# Altium project Protone.PrjPcb
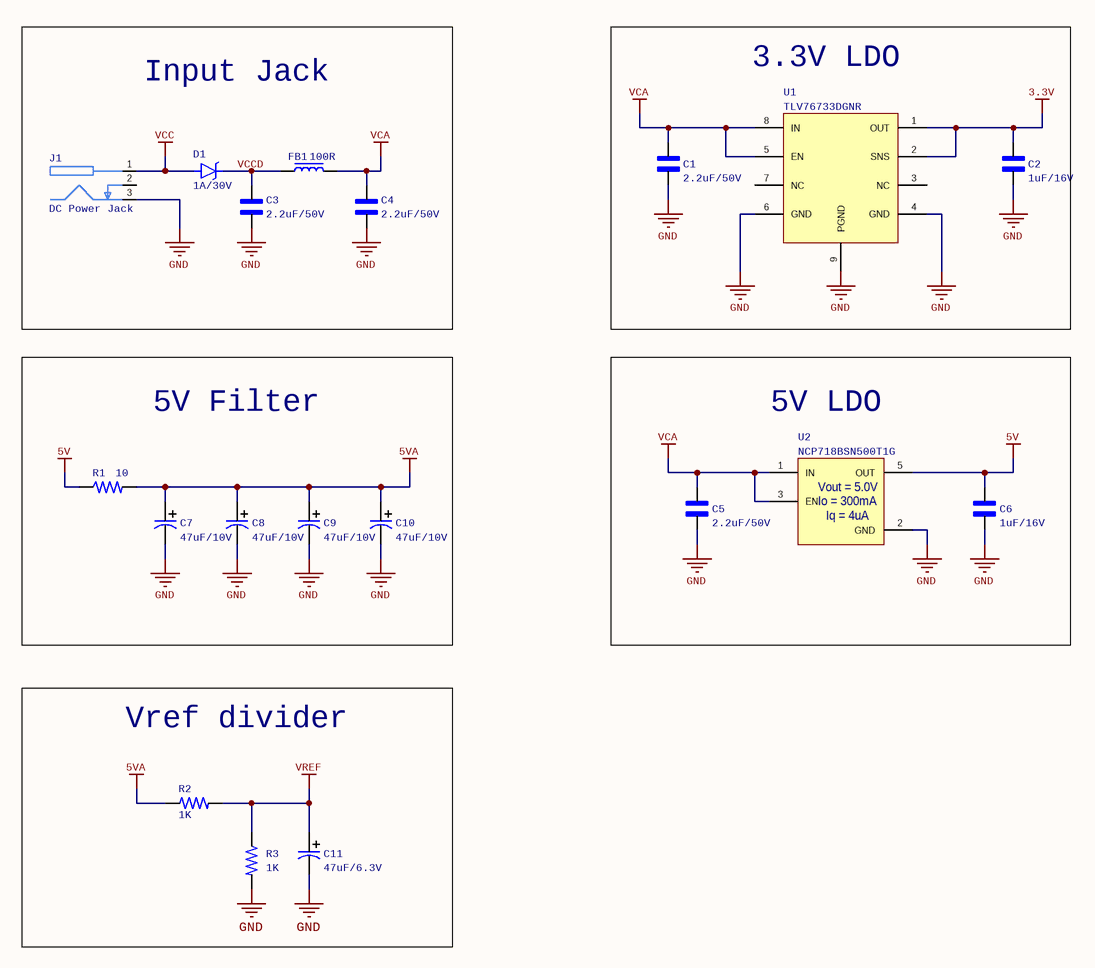
[diagram p0: [1] Power Supply.SchDoc]
5 sheets, 113 parts. Net scope: flat (ports and power ports of the same name join across sheets).
Board file: Protone.PcbDoc
Sheets:
  [1] Power Supply.SchDoc
  [2] Analog Front-End.SchDoc
  [3] Audio Codec.SchDoc
  [4] MCU.SchDoc
  [5] Connectors.SchDoc

## Sheet [1] Power Supply.SchDoc
size Letter

### Parts
C1  2.2uF/50V  [C1206]
C2  1uF/16V  [C0603]
C3  2.2uF/50V  [C1206]
C4  2.2uF/50V  [C1206]
C5  2.2uF/50V  [C1206]
C6  1uF/16V  [C0603]
C7  47uF/10V  [EIA1210]
C8  47uF/10V  [EIA1210]
C9  47uF/10V  [EIA1210]
C10  47uF/10V  [EIA1210]
C11  47uF/6.3V  [EIA1206]
D1  1A/30V  [SOD-323]
FB1  100R  [FB_0603]
J1  DC Power Jack  [DC Power Jack 2.1mm x 5.5mm]
R1  10  [R0603]
R2  1K  [R0603]
R3  1K  [R0603]
U1  TLV76733DGNR  [HVSSOP-8]
U2  NCP718BSN500T1G  [SOT23-5]

### Blocks framed on the sheet
Input Jack: C3 C4 D1 FB1 J1
3.3V LDO: C1 C2 U1
5V Filter: C7-C10 R1
5V LDO: C5 C6 U2
Vref divider: C11 R2 R3

### Nets
3.3V: C2.1 U1.1(OUT) U1.2(SNS)
5V: C6.1 R1.1 U2.5(OUT)
5VA: C7.1 C8.1 C9.1 C10.1 R1.2 R2.1
GND: C1.2 C2.2 C3.2 C4.2 C5.2 C6.2 C7.2 C8.2 C9.2 C10.2 C11.2 J1.3 R3.2 U1.4(GND) U1.6(GND) U1.9(PGND) U2.2(GND)
VCA: C1.1 C4.1 C5.1 FB1.2 U1.5(EN) U1.8(IN) U2.1(IN) U2.3(EN)
VCC: D1.A J1.1
VREF: C11.1 R2.2 R3.1
VCCD: C3.1 D1.C FB1.1

Not connected (* = marked no-connect by the designer): J1 2; U1 3(NC) 7(NC)

### Notes on the sheet
- (in symbol NCP718BSN500T1G) Vout = 5.0V; Io = 300mA; Iq = 4uA

### Library data of the parts
C1 C3-C5 = C1206 2.2uF/50V: MLCC 2.2uF 50V X7R 10% 1206; Manufacturer: KEMET; Manufacturer Part Number: C1206C225J5RECAUTO; Supplier 1: Mouser; Supplier Part Number 1: 80-C1206C225J5RECAUT; RoHS: Yes; Stock 1: 1416; Pricing 1: 1=0.26000, 10=0.11800, 50=0.11800, 100=0.10100, 1000=0.10100, 10000=0.10100 (USD)
C2 C6 = C0603 1uF/16V X5R: MLCC 1uF 16V X5R 10% SMD 0603 85C Paper T/R; Manufacturer: Yageo; Manufacturer Part Number: CC0603KRX5R7BB105; Dissipation Factor: 7%; Supplier 1: Mouser; Supplier Part Number 1: 603-CC603KRX5R7BB105; RoHS: Yes; Category: Ceramic Capacitors; Stock 1: 726921; Pricing 1: 1=0.17000, 10=0.09100, 50=0.09100, 100=0.04100, 1000=0.03400, 10000=0.02100 (USD); Mount: Surface Mount; Case/Package: 0603; Number of Pins: 2; Case Code (Imperial): 0603; Case Code (Metric): 1608; Min Operating Temperature: -55°C; Max Operating Temperature: 85°C; Capacitance: 1uF; Tolerance: 10%; Dielectric: X5R; Voltage Rating: 16V; Voltage Rating (DC): 16V; Packaging: Tape and Reel; Package Quantity: 4000; Termination: SMD/SMT; Resistor Type: Ceramic; Series: CC; Construction: Flat; Length: 1.6mm; Width: 0.8mm; Height: 0.8mm; Thickness: 0.035inch; Depth: 0.8mm; Radiation Hardening: No; REACH SVHC: Unknown; Lead Free: Lead Free; Halogen Free: Halogen Free; RoHS Compliant: Yes
C7-C10 = TANT 47UF/10V: Tantalum Capacitors - Solid SMD 10V 47uF 10%; Manufacturer: Kyocera AVX; Manufacturer Part Number: TAJB476K010RNJ; ESR (Equivalent Series Resistance): 1R; Leakage Current: 4.7uA; Polarity: Polar; Dissipation Factor: 8%; Supplier 1: Mouser; RoHS: Yes; Category: Tantalum Capacitors; Stock 1: 71514; Pricing 1: 1=0.46, 10=0.234, 50=0.234, 100=0.201, 1000=0.127, 10000=0.103 (USD); Mount: Surface Mount,PCB; Case/Package: 1210; Case Code (Metric): 3528; Case Code (Imperial): 1411; Dielectric Material: Tantalum; Min Operating Temperature: -55°C; Max Operating Temperature: 125°C; Capacitance: 47uF; Tolerance: 10%; Voltage Rating: 10V; Package Quantity: 2000; Packaging: Tape and Reel; Voltage Rating (DC): 10V; Termination: SMD/SMT; Voltage: 10V; Features: General Purpose; Series: TAJ; Length: 3.5mm; Width: 2.8mm; Height: 1.9mm; Depth: 2.8mm; Radiation Hardening: No; Lead Free: Lead Free; RoHS Compliant: Yes; Reach SVHC Compliant: No; Supplier Part Number 1: 581-TAJB476K010; Number of Pins: 2; Construction: Flat; Lead Pitch: 1.4mm
C11 = TANT 47UF/6.3V: Tantalum Capacitors - Solid SMD 6.3V 47uF 10%; Manufacturer: Kyocera AVX; Manufacturer Part Number: TAJA476K006SNJV; Supplier 1: Mouser; Supplier Part Number 1: 581-TAJA476K006SNJV; RoHS: Yes; Category: Tantalum Capacitors; Stock 1: 97469; Pricing 1: 1=0,57000, 10=0,39900, 50=0,39900, 100=0,20200, 1000=0,15200, 10000=0,12500 (USD); Case/Package: Radial; Voltage Rating (DC): 6.3V; Capacitance: 47uF; Tolerance: 10%; Lead Free: Lead Free; RoHS Compliant: Yes
D1 = Schottky BAT760Q-7: 30V 1A SOD323 DIODE SCHOTTKY; Manufacturer: Diodes; Supplier 1: Mouser; Supplier Part Number 1: 621-BAT760Q-7; Manufacturer Part Number: BAT760Q-7; RoHS: Yes; Category: Rectifier Diodes; Stock 1: 1305; Pricing 1: 1=0.41000, 10=0.27600, 50=0.27600, 100=0.14400, 1000=0.10000, 10000=0.07700 (USD); Mount: Surface Mount; Packaging: Tape and Reel; Average Rectified Current: 1A; Max Reverse Voltage (DC): 30V; RoHS Compliant: Yes
FB1 = FB_0603: Ferrite Bead SMD 0603
J1 = DC Power Jack 2.1mm x 5.5mm: DC Power Connectors Power Jack/Connector 2.1mm x 5.5mm; Manufacturer: Gravitech; Manufacturer Part Number: CON-SOCJ-2155; Supplier 1: Mouser; Supplier Part Number 1: 992-CON-SOCJ-2155; RoHS: Yes; Category: Uncategorized; Stock 1: 2595; Pricing 1: 1=1.00000, 5=1.00000 (USD); Color: Black; Connector Type: Power; Contact Gender: Female
R1 = R0603 10: RES 0603 10 OHM 0.5% 1/10W; Manufacturer: Yageo; Manufacturer Part Number: RT0603DRE0710RL; Resistance: 10R; Max Power Dissipation: 100mW; Voltage Rating (DC): 50V; Supplier 1: Mouser; Supplier Part Number 1: 603-RT0603DRE0710RL; RoHS: Yes; Category: Chip SMD Resistors; Case/Package: 0603; Case Code (Metric): 1608; Case Code (Imperial): 0603; Tolerance: 0.5%; Resistor Type: Thin Film; Number of Terminations: 2
R2 R3 = R0603 1K: Res Thick Film 0603 1K Ohm 1% 1/10W ±50ppm/°C Molded SMD Paper T/R; Manufacturer: Yageo; Manufacturer Part Number: RE0603FRE071KL; Resistance: 1kR; Max Power Dissipation: 100mW; Supplier 1: Mouser; Supplier Part Number 1: 603-RE0603FRE071KL; RoHS: Yes; Category: Chip SMD Resistors; Stock 1: 21464; Pricing 1: 1=0.11000, 10=0.03800, 50=0.03800, 100=0.01700, 1000=0.00800, 10000=0.00500 (USD); Case/Package: 0603; Min Operating Temperature: -55°C; Max Operating Temperature: 155°C; Packaging: Tape and Reel; Resistor Type: Thick Film; Number of Terminations: 2; Tolerance: 1%; Temperature Coefficient: 50ppm/°C; Features: Moisture Resistant; Length: 0.063inch; Width: 0.032inch; Height: 0.022inch; RoHS Compliant: Yes; ComponentLink1URL: http://www.yageo.com/NewPortal/yageodocoutput?fileName=/pdf/R-Chip/PYu-RE_105_RoHS_L_4.pdf&src-supplier=Digi-Key; ComponentLink1Description: http://www.yageo.com/NewPortal/yageodocoutput?fileName=/pdf/R-Chip/PYu-RE_105_RoHS_L_4.pdf&src-supplier=Digi-Key
U1 = TLV76733DGNR: Fixed-output, 1-A, 16-V, positive-voltage low-dropout (LDO) linear regulator 8-HVSSOP -40 to 125; Manufacturer: Texas Instruments; Supplier 1: Mouser; Manufacturer Part Number: TLV76733DGNR; RoHS: Yes; Category: Integrated Circuits (ICs); Stock 1: 27181; Pricing 1: 1=0.88, 10=0.784, 50=0.744, 100=0.611, 1000=0.399, 10000=0.33 (USD); Supplier Part Number 1: 595-TLV76733DGNR
U2 = NCP718BSN500T1G: LDO Regulator, 300 mA, Wide Vin, Ultra-Low Iq Fixed 5.0V, Non-Active Discharge, TSOT23-5; Manufacturer: ON Semiconductor; Supplier 1: Mouser; Manufacturer Part Number: NCP718BSN500T1G; RoHS: Yes; Category: Voltage Regulators - Linear; Stock 1: 32274; Pricing 1: 1=0.61, 10=0.534, 50=0.534, 100=0.37, 1000=0.22, 10000=0.182 (USD); RoHS Compliant: Yes; Supplier Part Number 1: 863-NCP718BSN500T1G

## Sheet [2] Analog Front-End.SchDoc
size Letter
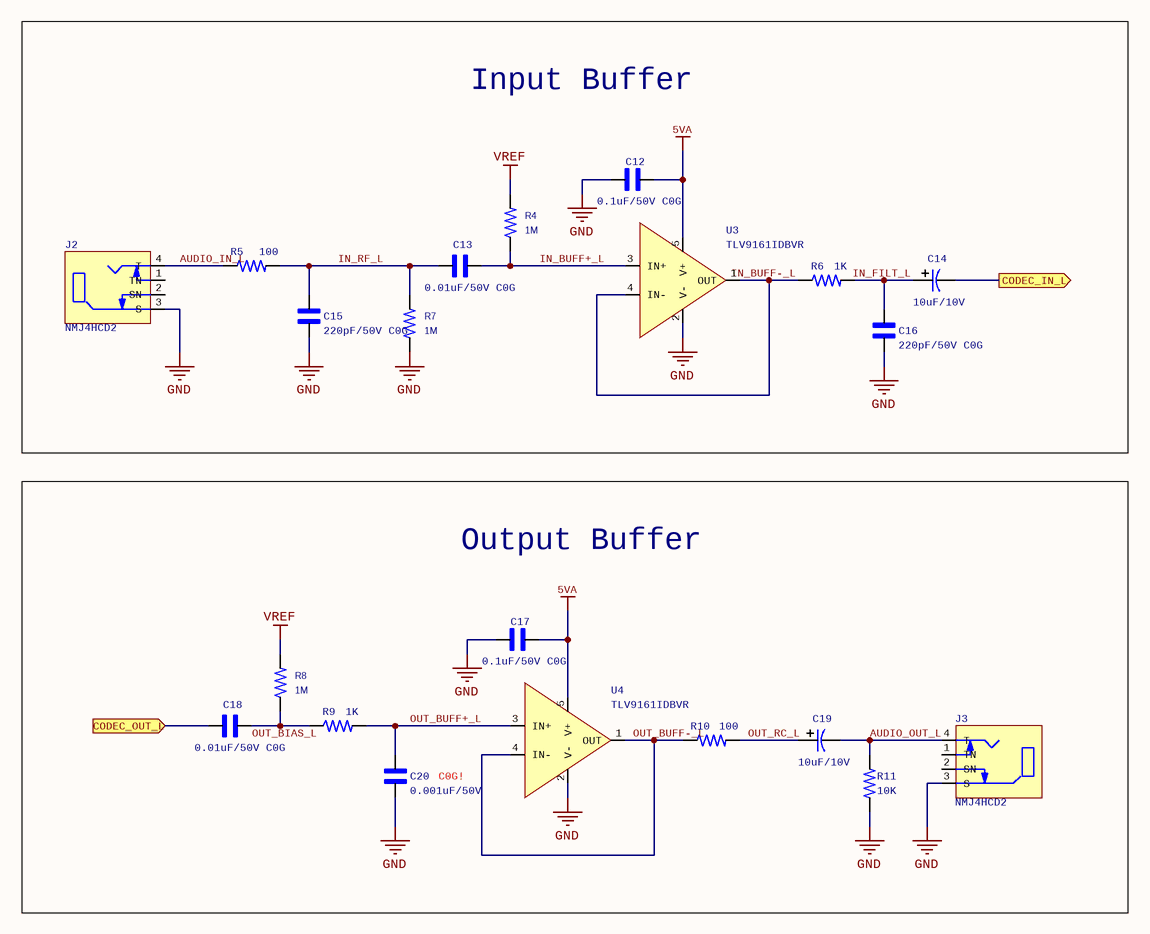
[diagram p1: [2] Analog Front-End.SchDoc]

### Parts
C12  0.1uF/50V C0G  [C0603]
C13  0.01uF/50V C0G  [C0603]
C14  10uF/10V  [EIA1206]
C15  220pF/50V C0G  [C0603]
C16  220pF/50V C0G  [C0603]
C17  0.1uF/50V C0G  [C0603]
C18  0.01uF/50V C0G  [C0603]
C19  10uF/10V  [EIA1206]
C20  0.001uF/50V  [C0603]
J2  NMJ4HCD2  [NMJ4HCD2]
J3  NMJ4HCD2  [NMJ4HCD2]
R4  1M  [R0603]
R5  100  [R0603]
R6  1K  [R0603]
R7  1M  [R0603]
R8  1M  [R0603]
R9  1K  [R0603]
R10  100  [R0603]
R11  10K  [R0603]
U3  TLV9161IDBVR  [SOT23-5]
U4  TLV9161IDBVR  [SOT23-5]

### Blocks framed on the sheet
Input Buffer: C12-C16 J2 R4-R7 U3
Output Buffer: C17-C20 J3 R8-R11 U4

### Ports
CODEC_IN_L (out), CODEC_OUT_L (in)

### Nets
5VA: C12.1 C17.1 U3.5(V+) U4.5(V+)
GND: C12.2 C15.2 C16.2 C17.2 C20.1 J2.3(S) J3.3(S) R7.1 R11.1 U3.2(V-) U4.2(V-)
VREF: R4.2 R8.2
AUDIO_IN_L: J2.4(T) R5.1
AUDIO_OUT_L: C19.2 J3.4(T) R11.2
CODEC_IN_L: C14.2 ; port CODEC_IN_L
CODEC_OUT_L: C18.1 ; port CODEC_OUT_L
IN_BUFF+_L: C13.2 R4.1 U3.3(IN+)
IN_BUFF-_L: R6.1 U3.1(OUT) U3.4(IN-)
IN_FILT_L: C14.1 C16.1 R6.2
IN_RF_L: C13.1 C15.1 R5.2 R7.2
OUT_BIAS_L: C18.2 R8.1 R9.1
OUT_BUFF+_L: C20.2 R9.2 U4.3(IN+)
OUT_BUFF-_L: R10.1 U4.1(OUT) U4.4(IN-)
OUT_RC_L: C19.1 R10.2

Not connected (* = marked no-connect by the designer): J2 1(TN) 2(SN); J3 1(TN) 2(SN)

### Notes on the sheet
- C0G!

### Library data of the parts
C12 C17 = C0603 0.1uF/50V: MLCC 0.1uF 50V C0G 10% 0603; Manufacturer: TDK; Manufacturer Part Number: C1608X5R1H104K080AA; Dielectric Material: Ceramic; Capacitance: 100nF; Dielectric: X5R; Supplier 1: Mouser; Supplier Part Number 1: 810-C1608X5R1H104K; RoHS: Yes; Category: Ceramic Capacitors; Stock 1: 520600; Pricing 1: 1=0.12000, 10=0.04500, 100=0.03700, 500=0.02600, 1000=0.02100, 4000=0.01800 (USD); Mount: Surface Mount; Case/Package: 0603; Number of Pins: 2; Case Code (Metric): 1608; Case Code (Imperial): 0603; Weight: 7.1E-05oz; Min Operating Temperature: -55°C; Max Operating Temperature: 85°C; Tolerance: 10%; Voltage Rating: 50V; Packaging: Tape and Reel; Voltage Rating (DC): 50V; Termination: SMD/SMT; Package Quantity: 1; Resistor Type: Ceramic; Length: 1.6mm; Width: 0.031inch; Height: 0.8mm; Depth: 0.8mm; Thickness: 0.035inch; Radiation Hardening: No; REACH SVHC: No SVHC; Lead Free: Lead Free; Supplier 2: Mouser; Supplier Part Number 2: 187-CL10B104KB8NNNC
C13 C18 = C0603 0.01uF/50V C0G: MLCC 0.01uF 50V C0G 5% 0603; Manufacturer: Murata; Manufacturer Part Number: GRM1885C1H103JA01J; Capacitance: 10nF; Material: 4241ConductorMaterial; Temperature Coefficient: 30ppm/°C; Supplier 1: Mouser; Supplier Part Number 1: 81-GRM1885C1H103JA1J; RoHS: Yes; Category: Ceramic Capacitors; Stock 1: 193832; Pricing 1: 1=0.13, 10=0.052, 50=0.052, 100=0.03, 1000=0.025, 10000=0.018 (USD); Mount: Surface Mount; Case/Package: 0603; Case Code (Metric): 1608; Case Code (Imperial): 0603; Min Operating Temperature: -55°C; Max Operating Temperature: 125°C; Package Quantity: 10000; Packaging: Tape and Reel; Tolerance: 5%; Voltage Rating: 50V; Dielectric: C0G; Termination: SMD/SMT; Voltage Rating (DC): 50V; Series: GRM; Length: 1.6mm; Width: 0.8mm; Height: 0.8mm; RoHS Compliant: Yes; Weight: 0.000222oz
C14 C19 = TANT 10UF/10V: Tantalum Capacitors - Solid SMD 10V 10uF 10%; Manufacturer: KEMET; Manufacturer Part Number: T491A106K010AT; ESR (Equivalent Series Resistance): 4R; Life (Hours): 2000Hour; Polarity: Polar; Dissipation Factor: 6%; Leakage Current: 1uA; Ripple Current: 137mA; Supplier 1: Mouser; RoHS: Yes; Category: Tantalum Capacitors; Stock 1: 88800; Supplier Part Number 1: 80-T491A106K010; Mount: Surface Mount,PCB; Case/Package: 1206; Case Code (Metric): 3216; Case Code (Imperial): 1206; Dielectric Material: Tantalum; Min Operating Temperature: -55°C; Max Operating Temperature: 125°C; Capacitance: 10uF; Tolerance: 10%; Packaging: Tape and Reel; Voltage Rating: 10V; Features: General Purpose; Package Quantity: 2000; Termination: SMD/SMT; Voltage Rating (DC): 10V; Voltage: 10V; Length: 3.2mm; Width: 0.063inch; Height: 1.6mm; Depth: 1.6mm; Height - Seated (Max): 0.071inch; Lead Free: Lead Free; REACH SVHC: No SVHC; Supplier 2: LCSC; Supplier Part Number 2: C110052
C15 C16 = C0603 220pF/50V C0G: MLCC 220pF 50V C0G 5% 0603; Manufacturer: KEMET; Manufacturer Part Number: C0603C221J5GACTU; Dielectric Material: Ceramic; Material: 4241ConductorMaterial; Dissipation Factor: 0.1%; Temperature Coefficient: 30ppm/°C; Supplier 1: Mouser; Supplier Part Number 1: 80-C0603C221J5G; RoHS: Yes; Category: Ceramic Capacitors; Stock 1: 174318; Pricing 1: 1=0.1, 10=0.027, 50=0.027, 100=0.016, 1000=0.011, 10000=0.007 (USD); Mount: Surface Mount; Case/Package: 0603; Min Operating Temperature: -55°C; Max Operating Temperature: 125°C; Packaging: Tape and Reel; Tolerance: 5%; Capacitance: 220pF; Dielectric: C0G; Termination: SMD/SMT; Voltage Rating (DC): 50V; Voltage: 50V; Length: 1.6mm; Height: 0.8mm; Depth: 0.8mm; Radiation Hardening: No; Number of Pins: 2; Case Code (Imperial): 0603; Case Code (Metric): 1608; Package Quantity: 1; Voltage Rating: 50V; Series: C; Construction: Flat; Voltage Rating (AC): 50V; Width: 0.8mm; Thickness: 0.034inch; Lead Pitch: 0.7mm; Lead Free: Lead Free; Reach SVHC Compliant: No; RoHS Compliant: Yes
C20 = C0603 0.001uF/50V: MLCC 0.001uF 50V X5R 10% 0603; Manufacturer: Samsung; Manufacturer Part Number: CL10B102KB8NNNL; Capacitance: 1nF; Dielectric: X7R; Supplier 1: Mouser; Supplier Part Number 1: 187-CL10B102KB8NNNL; RoHS: Yes; Category: Ceramic Capacitors; Stock 1: 55616; Pricing 1: 1=0.10000, 10=0.03500, 50=0.03500, 100=0.01600, 1000=0.00900, 10000=0.00600 (USD); Mount: Surface Mount; Case/Package: 0603; Min Operating Temperature: -55°C; Max Operating Temperature: 125°C; Package Quantity: 15000; Packaging: Tape and Reel; Tolerance: 10%; Voltage Rating: 50V; Voltage Rating (DC): 50V; Series: CL; Construction: Flat; Length: 1.6mm; Width: 0.031inch; Height: 0.8mm; Thickness: 0.035inch; Depth: 0.8mm; Radiation Hardening: No; Lead Free: Lead Free; RoHS Compliant: Yes
J2 J3 = TS Audio Jack 6.3mm: Phone Connectors 2C MONO 2-SPST NC; Manufacturer: Neutrik; Number of Terminals/Pins: 4; Max Current Rating: 3A; Gender: Female; Voltage Rating: 50V; Number of Ports: 1; Number of Contacts: 2; Supplier 1: Mouser; Supplier Part Number 1: 550-12202; Manufacturer Part Number: NMJ4HCD2; RoHS: Yes; Category: Audio / Video Connectors; Stock 1: 39770; Pricing 1: 1=1,51000, 10=1,39000, 50=1,36000, 100=1,18000, 1000=1,11000, 10000=1,10000 (USD); Mount: Through Hole; Number of Pins: 4; Contact Plating: Silver; Color: Black; Contact Material: Brass; Weight: 0.246918oz; Housing Material: Polyamide; Min Operating Temperature: -25°C; Max Operating Temperature: 70°C; Package Quantity: 200; Termination: Through Hole; Orientation: Horizontal; Series: M; RoHS Compliant: Yes; ComponentLink1URL: https://datasheet.ciiva.com/16148/210-199761-16148179.pdf?src-supplier=Onlinecomponents.com; ComponentLink1Description: https://datasheet.ciiva.com/16148/210-199761-16148179.pdf?src-supplier=Onlinecomponents.com
R4 R7 R8 = R0603 1M: RES SMD 1M OHM 1% 1/10W 0603; Manufacturer: Yageo; Manufacturer Part Number: RC0603FR-071ML; Voltage Rating: 75V; Voltage Rating (DC): 50V; Resistance: 1MR; Power Rating: 100mW; Temperature Coefficient: 100ppm/°C; Application(s): HIGH RELIABILITY; Supplier 1: Mouser; Supplier Part Number 1: 603-RC0603FR-071ML; RoHS: Yes; Category: Chip SMD Resistors; Stock 1: 1321822; Pricing 1: 1=0.10000, 10=0.01800, 50=0.01800, 100=0.00700, 1000=0.00400, 10000=0.00200 (USD); Case/Package: 0603; Number of Pins: 2; Case Code (Imperial): 0603; Case Code (Metric): 1608; Weight: 0.000847oz; Min Operating Temperature: -55°C; Max Operating Temperature: 155°C; Tolerance: 1%; Packaging: Cut Tape; Package Quantity: 5000; Termination: SMD/SMT; Resistor Type: Thick Film; Type: General Purpose; Series: RC; Technology: THICK FILM; Length: 1.6mm; Width: 0.8mm; Height: 0.45mm; Depth: 0.8mm; RoHS Compliant: Yes; REACH SVHC: No SVHC; Military Standard: Not; Lead Free: Lead Free
R5 R10 = R0603 100: RES 0603 100 OHM 1% 1/10W; Manufacturer: Yageo; Manufacturer Part Number: RC0603FR-07100RL; Resistance: 100R; Temperature Coefficient: 100ppm/°C; Power Rating: 100mW; Voltage Rating: 50V; Supplier 1: Mouser; Supplier Part Number 1: 603-RC0603FR-07100RL; RoHS: Yes; Category: Chip SMD Resistors; Stock 1: 62434; Pricing 1: 1=0.10000, 10=0.02200, 50=0.02200, 100=0.00800, 1000=0.00600, 10000=0.00400 (USD); Case/Package: 0603; Case Code (Imperial): 0603; Case Code (Metric): 1608; Min Operating Temperature: -55°C; Max Operating Temperature: 155°C; Tolerance: 1%; Resistor Type: Thick Film; Packaging: Tape and Reel; Termination: SMD/SMT; Number of Terminations: 2; Length: 1.6mm; Height: 0.022inch; Width: 0.031inch; Depth: 0.8mm; Lead Free: Lead Free; Military Standard: Not; Contact Plating: Tin,Matte; Weight: 7.1E-05oz; Size Code: 0603; Max Power Dissipation: 100mW; Features: Moisture Resistant,Automotive AEC-Q200; Series: AC; Construction: Rectangular; Radiation Hardening: No; RoHS Compliant: Yes
R6 R9 = R0603 1K: as R2 on sheet [1] Power Supply; Supplier 1: Mouser; Supplier Part Number 1: 603-RE0603FRE071KL; RoHS: Yes; Category: Chip SMD Resistors; Stock 1: 21464; Pricing 1: 1=0.11000, 10=0.03800, 50=0.03800, 100=0.01700, 1000=0.00800, 10000=0.00500 (USD); Case/Package: 0603; Min Operating Temperature: -55°C; Max Operating Temperature: 155°C; Packaging: Tape and Reel; Resistor Type: Thick Film; Number of Terminations: 2; Tolerance: 1%; Temperature Coefficient: 50ppm/°C; Features: Moisture Resistant; Length: 0.063inch; Width: 0.032inch; Height: 0.022inch; RoHS Compliant: Yes; ComponentLink1URL: http://www.yageo.com/NewPortal/yageodocoutput?fileName=/pdf/R-Chip/PYu-RE_105_RoHS_L_4.pdf&src-supplier=Digi-Key; ComponentLink1Description: http://www.yageo.com/NewPortal/yageodocoutput?fileName=/pdf/R-Chip/PYu-RE_105_RoHS_L_4.pdf&src-supplier=Digi-Key
R11 = R0603 10K: RES 0603 10K OHM 1% 1/10W; Manufacturer: Yageo; Manufacturer Part Number: RC0603FR-0710KP; Resistance: 10kR; Max Power Dissipation: 100mW; Temperature Coefficient: 150ppm/°C; Supplier 1: Mouser; Supplier Part Number 1: 603-RC0603FR-0710KP; RoHS: Yes; Category: Chip SMD Resistors; Stock 1: 6316; Pricing 1: 1=0.18000, 10=0.04200, 50=0.04200, 100=0.01400, 1000=0.01000, 10000=0.00600 (USD); Case/Package: 0603; Case Code (Metric): 1608; Case Code (Imperial): 0603; Min Operating Temperature: -55°C; Max Operating Temperature: 155°C; Packaging: Tape and Reel; Tolerance: 1%; Resistor Type: Thick Film; Number of Terminations: 2; Features: Moisture Resistant; Length: 0.063inch; Width: 0.031inch; Height: 0.022inch; RoHS Compliant: Yes
U3 U4 = TLV9161IDBVR: Single 10-MHz, 16-V rail-to-rail input/output, very low noise, high slew rate op amp 5-SOT-23 -40 to 125; Manufacturer: Texas Instruments; Supplier 1: Mouser; Manufacturer Part Number: TLV9161IDBVR; RoHS: No; Category: Amplifiers - Op Amps, Buffer, Instrumentation; Stock 1: 20844; Pricing 1: 1=0.94, 10=0.839, 50=0.839, 100=0.654, 1000=0.435, 10000=0.375 (USD); Supplier Part Number 1: 595-TLV9161IDBVR

## Sheet [3] Audio Codec.SchDoc
size Letter
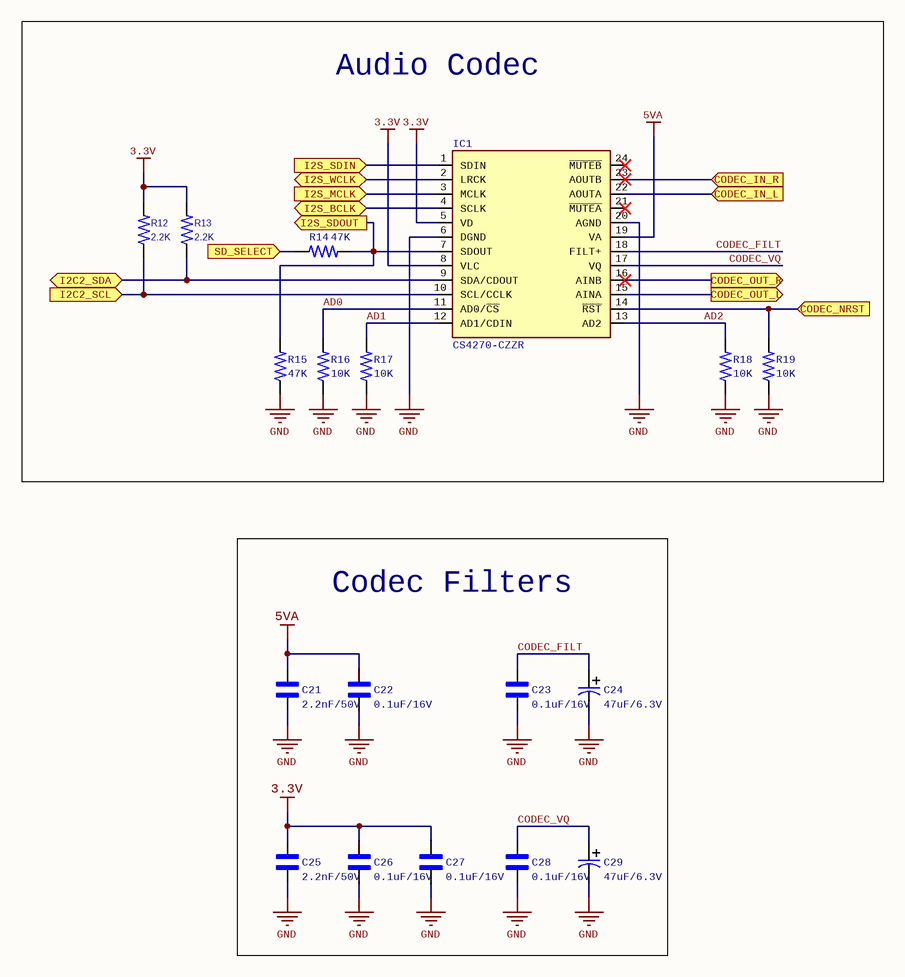
[diagram p2: [3] Audio Codec.SchDoc]

### Parts
C21  2.2nF/50V  [C0603]
C22  0.1uF/16V  [C0603]
C23  0.1uF/16V  [C0603]
C24  47uF/6.3V  [EIA1206]
C25  2.2nF/50V  [C0603]
C26  0.1uF/16V  [C0603]
C27  0.1uF/16V  [C0603]
C28  0.1uF/16V  [C0603]
C29  47uF/6.3V  [EIA1206]
IC1  CS4270-CZZR  [TSSOP-24]
R12  2.2K  [R0603]
R13  2.2K  [R0603]
R14  47K  [R0603]
R15  47K  [R0603]
R16  10K  [R0603]
R17  10K  [R0603]
R18  10K  [R0603]
R19  10K  [R0603]

### Blocks framed on the sheet
Audio Codec: IC1 R12-R19
Codec Filters: C21-C29

### Ports
CODEC_IN_L (in), CODEC_IN_R (in), CODEC_NRST (in), CODEC_OUT_L (out), CODEC_OUT_R (out), I2C2_SCL (in), I2C2_SDA (bidir), I2S_BCLK (bidir), I2S_MCLK (in), I2S_SDIN (in), I2S_SDOUT (out), I2S_WCLK (bidir), SD_SELECT (in)

### Nets
3.3V: C25.1 C26.2 C27.2 IC1.5(VD) IC1.8(VLC) R12.2 R13.2
5VA: C21.1 C22.2 IC1.19(VA)
GND: C21.2 C22.1 C23.1 C24.2 C25.2 C26.1 C27.1 C28.1 C29.2 IC1.6(DGND) IC1.20(AGND) R15.1 R16.1 R17.1 R18.1 R19.1
AD0: IC1.11(AD0/~{CS}) R16.2
AD1: IC1.12(AD1/CDIN) R17.2
AD2: IC1.13(AD2) R18.2
CODEC_FILT: C23.2 C24.1 IC1.18(FILT+)
CODEC_IN_L: IC1.22(AOUTA) ; port CODEC_IN_L
CODEC_IN_R: IC1.23(AOUTB) ; port CODEC_IN_R
CODEC_NRST: IC1.14(~{RST}) R19.2 ; port CODEC_NRST
CODEC_OUT_L: IC1.15(AINA) ; port CODEC_OUT_L
CODEC_OUT_R: IC1.16(AINB) ; port CODEC_OUT_R
CODEC_VQ: C28.2 C29.1 IC1.17(VQ)
I2C2_SCL: IC1.10(SCL/CCLK) R12.1 ; port I2C2_SCL
I2C2_SDA: IC1.9(SDA/CDOUT) R13.1 ; port I2C2_SDA
I2S_BCLK: IC1.4(SCLK) ; port I2S_BCLK
I2S_MCLK: IC1.3(MCLK) ; port I2S_MCLK
I2S_SDIN: IC1.1(SDIN) ; port I2S_SDIN
I2S_SDOUT: IC1.7(SDOUT) R14.2 R15.2 ; port I2S_SDOUT
I2S_WCLK: IC1.2(LRCK) ; port I2S_WCLK
SD_SELECT: R14.1 ; port SD_SELECT

Not connected (* = marked no-connect by the designer): IC1 21(~{MUTEA})* 24(~{MUTEB})*

### Library data of the parts
C21 C25 = C0603 2.2nF/50V: MLCC 2.2nF 10V X5R 10% 0603; Manufacturer: Samsung; Manufacturer Part Number: CL10B222KB8NFNC; Voltage Rating: 50V; Dielectric: X7R; Supplier 1: Mouser; Supplier Part Number 1: 187-CL10B222KB8NFNC; RoHS: Yes; Category: Ceramic Capacitors; Stock 1: 114857; Pricing 1: 1=0.10000, 10=0.03800, 50=0.03800, 100=0.01700, 1000=0.00900, 10000=0.00600 (USD); Mount: Surface Mount; Case/Package: 0603; Case Code (Metric): 1608; Case Code (Imperial): 0603; Min Operating Temperature: -55°C; Max Operating Temperature: 125°C; Package Quantity: 1; Packaging: Tape and Reel; Capacitance: 2.2nF; Tolerance: 10%; Series: CL; Construction: Flat; Length: 0.063inch; Width: 0.031inch; Height: 0.8mm; Thickness: 0.035inch; Depth: 0.8mm; Radiation Hardening: No; RoHS Compliant: Yes
C22 C23 C26-C28 = C0603 0.1uF/16V: MLCC 0.1UF, 16V, X5R, 10%, 0603.; Manufacturer: Kyocera AVX; Manufacturer Part Number: 0603YD104KAT2A; Capacitance: 100nF; Supplier 1: Mouser; Supplier Part Number 1: 581-0603YD104KAT2A; RoHS: Yes; Category: Ceramic Capacitors; Stock 1: 3315; Pricing 1: 1=0.26000, 10=0.11400, 50=0.11400, 100=0.09700, 1000=0.05900, 10000=0.04800 (USD); Mount: Surface Mount; Case/Package: 0603; Number of Pins: 2; Case Code (Imperial): 0603; Case Code (Metric): 1608; Min Operating Temperature: -55°C; Max Operating Temperature: 85°C; Package Quantity: 4000; Voltage Rating: 16V; Voltage Rating (DC): 16V; Tolerance: 10%; Packaging: Tape and Reel; Dielectric: X5R; Termination: SMD/SMT; Length: 1.6mm; Width: 0.81mm; Height: 0.9mm; Thickness: 0.035inch; Depth: 0.81mm; Lead Free: Lead Free; ComponentLink1URL: https://datasheet.ciiva.com/11504/cx5r-11504040.pdf?src-supplier=Avnet; ComponentLink1Description: https://datasheet.ciiva.com/11504/cx5r-11504040.pdf?src-supplier=Avnet; ComponentLink2URL: https://datasheet.ciiva.com/208/cx5r-208121.pdf?src-supplier=Digi-Key; ComponentLink2Description: https://datasheet.ciiva.com/208/cx5r-208121.pdf?src-supplier=Digi-Key
C24 C29 = TANT 47UF/6.3V: as C11 on sheet [1] Power Supply; Supplier 1: Mouser; Supplier Part Number 1: 581-TAJA476K006SNJV; RoHS: Yes; Category: Tantalum Capacitors; Stock 1: 97469; Pricing 1: 1=0,57000, 10=0,39900, 50=0,39900, 100=0,20200, 1000=0,15200, 10000=0,12500 (USD); Case/Package: Radial; Voltage Rating (DC): 6.3V; Capacitance: 47uF; Tolerance: 10%; Lead Free: Lead Free; RoHS Compliant: Yes
IC1 = CS4270-CZZR: Audio Codec 2ADC / 2DAC 24-Bit 24-Pin TSSOP T/R (Alt: CS4270-CZZR); Manufacturer: Cirrus Logic; Interface: I2C,SPI,Serial; Resolution: 24b; Number of A/D Converters: 2; Sampling Rate: 216KS/s; Supplier 1: Mouser; Manufacturer Part Number: CS4270-CZZR; RoHS: Yes; Category: CODECs; Stock 1: 20885; Pricing 1: 1=7.04, 10=6.36, 50=6.06, 100=5.27, 1000=4.4, 10000=4.4 (USD); Mount: Surface Mount; Case/Package: TSSOP; Number of Pins: 24; Contact Plating: Tin,Matte; Min Operating Temperature: -10°C; Max Operating Temperature: 70°C; Packaging: Tape and Reel; Package Quantity: 4000; Number of D/A Converters: 2; Series: -; RoHS Compliant: Yes; Supplier Part Number 1: 777-CS4270-CZZR
R12 R13 = R0603 2.2K: RES 0603 2.2K OHM 1% 1/10W; Manufacturer: Yageo; Manufacturer Part Number: RC0603FR-072K2L; Resistance: 2.2kR; Temperature Coefficient: 100ppm/°C; Power Rating: 100mW; Voltage Rating: 50V; Supplier 1: Mouser; Supplier Part Number 1: 603-RC0603FR-072K2L; RoHS: Yes; Category: Chip SMD Resistors; Stock 1: 372094; Pricing 1: 1=0.100000, 10=0.018000, 50=0.018000, 100=0.006000, 1000=0.005000, 10000=0.003000 (USD); Case/Package: 0603; Case Code (Imperial): 0603; Case Code (Metric): 1608; Size Code: 0603; Min Operating Temperature: -55°C; Max Operating Temperature: 155°C; Tolerance: 1%; Packaging: Tape and Reel; Resistor Type: Thick Film; Package Quantity: 1; Termination: SMD/SMT; Number of Terminations: 2; Max Power Dissipation: 100mW; Features: Moisture Resistant; Series: RC; Resistance Tolerance: 1%; Construction: Rectangular; Length: 1.6mm; Width: 0.031inch; Height: 0.022inch; Depth: 0.8mm; REACH SVHC: No SVHC; Lead Free: Lead Free; Military Standard: Not; RoHS Compliant: Yes
R14 = R0603 47K: RES 0603 47K 1% 1/10W; Manufacturer: Yageo; Manufacturer Part Number: RC0603FR-0747KL; Resistance: 47kR; Power Rating: 100mW; Voltage Rating (DC): 50V; Temperature Coefficient: 100ppm/°C; Supplier 1: Mouser; Supplier Part Number 1: 603-RC0603FR-0747KL; RoHS: Yes; Category: Chip SMD Resistors; Stock 1: 158656; Case/Package: 0603; Number of Pins: 2; Case Code (Imperial): 0603; Case Code (Metric): 1608; Min Operating Temperature: -55°C; Max Operating Temperature: 155°C; Tolerance: 1%; Packaging: Tape and Reel; Voltage Rating: 50V; Package Quantity: 1; Termination: SMD/SMT; Resistor Type: Thick Film; Number of Terminations: 2; Max Power Dissipation: 100mW; Features: Moisture Resistant; Length: 1.6mm; Width: 0.031inch; Height: 0.022inch; Depth: 0.8mm; REACH SVHC: Unknown; Lead Free: Lead Free; Military Standard: Not; Pricing 1: 1=0.10000, 10=0.02400, 50=0.02400, 100=0.01000, 1000=0.00400, 10000=0.00200 (USD); Size Code: 0603; Series: RC; Resistance Tolerance: 1%; Technology: THICK FILM; Construction: Rectangular; RoHS Compliant: Yes
R15 = R0603 47K: RES 0603 47K 1% 1/10W; Manufacturer: Yageo; Manufacturer Part Number: RC0603FR-0747KL; Resistance: 47kR; Temperature Coefficient: 100ppm/°C; Power Rating: 100mW; Voltage Rating: 50V; Supplier 1: Mouser; Supplier Part Number 1: 603-RC0603FR-0747KL; RoHS: Yes; Category: Chip SMD Resistors; Stock 1: 158656; Pricing 1: 1=0.10000, 10=0.02400, 50=0.02400, 100=0.01000, 1000=0.00400, 10000=0.00200 (USD); Case/Package: 0603; Number of Pins: 2; Case Code (Metric): 1608; Case Code (Imperial): 0603; Size Code: 0603; Min Operating Temperature: -55°C; Max Operating Temperature: 155°C; Tolerance: 1%; Resistor Type: Thick Film; Packaging: Tape and Reel; Voltage Rating (DC): 50V; Package Quantity: 1; Number of Terminations: 2; Termination: SMD/SMT; Max Power Dissipation: 100mW; Features: Moisture Resistant; Series: RC; Resistance Tolerance: 1%; Technology: THICK FILM; Construction: Rectangular; Length: 1.6mm; Width: 0.031inch; Height: 0.022inch; Depth: 0.8mm; REACH SVHC: Unknown; Military Standard: Not; Lead Free: Lead Free; RoHS Compliant: Yes
R16-R19 = R0603 10K: as R11 on sheet [2] Analog Front-End; Supplier 1: Mouser; Supplier Part Number 1: 603-RC0603FR-0710KP; RoHS: Yes; Category: Chip SMD Resistors; Stock 1: 6316; Pricing 1: 1=0.18000, 10=0.04200, 50=0.04200, 100=0.01400, 1000=0.01000, 10000=0.00600 (USD); Case/Package: 0603; Case Code (Metric): 1608; Case Code (Imperial): 0603; Min Operating Temperature: -55°C; Max Operating Temperature: 155°C; Packaging: Tape and Reel; Tolerance: 1%; Resistor Type: Thick Film; Number of Terminations: 2; Features: Moisture Resistant; Length: 0.063inch; Width: 0.031inch; Height: 0.022inch; RoHS Compliant: Yes

## Sheet [4] MCU.SchDoc
size A3
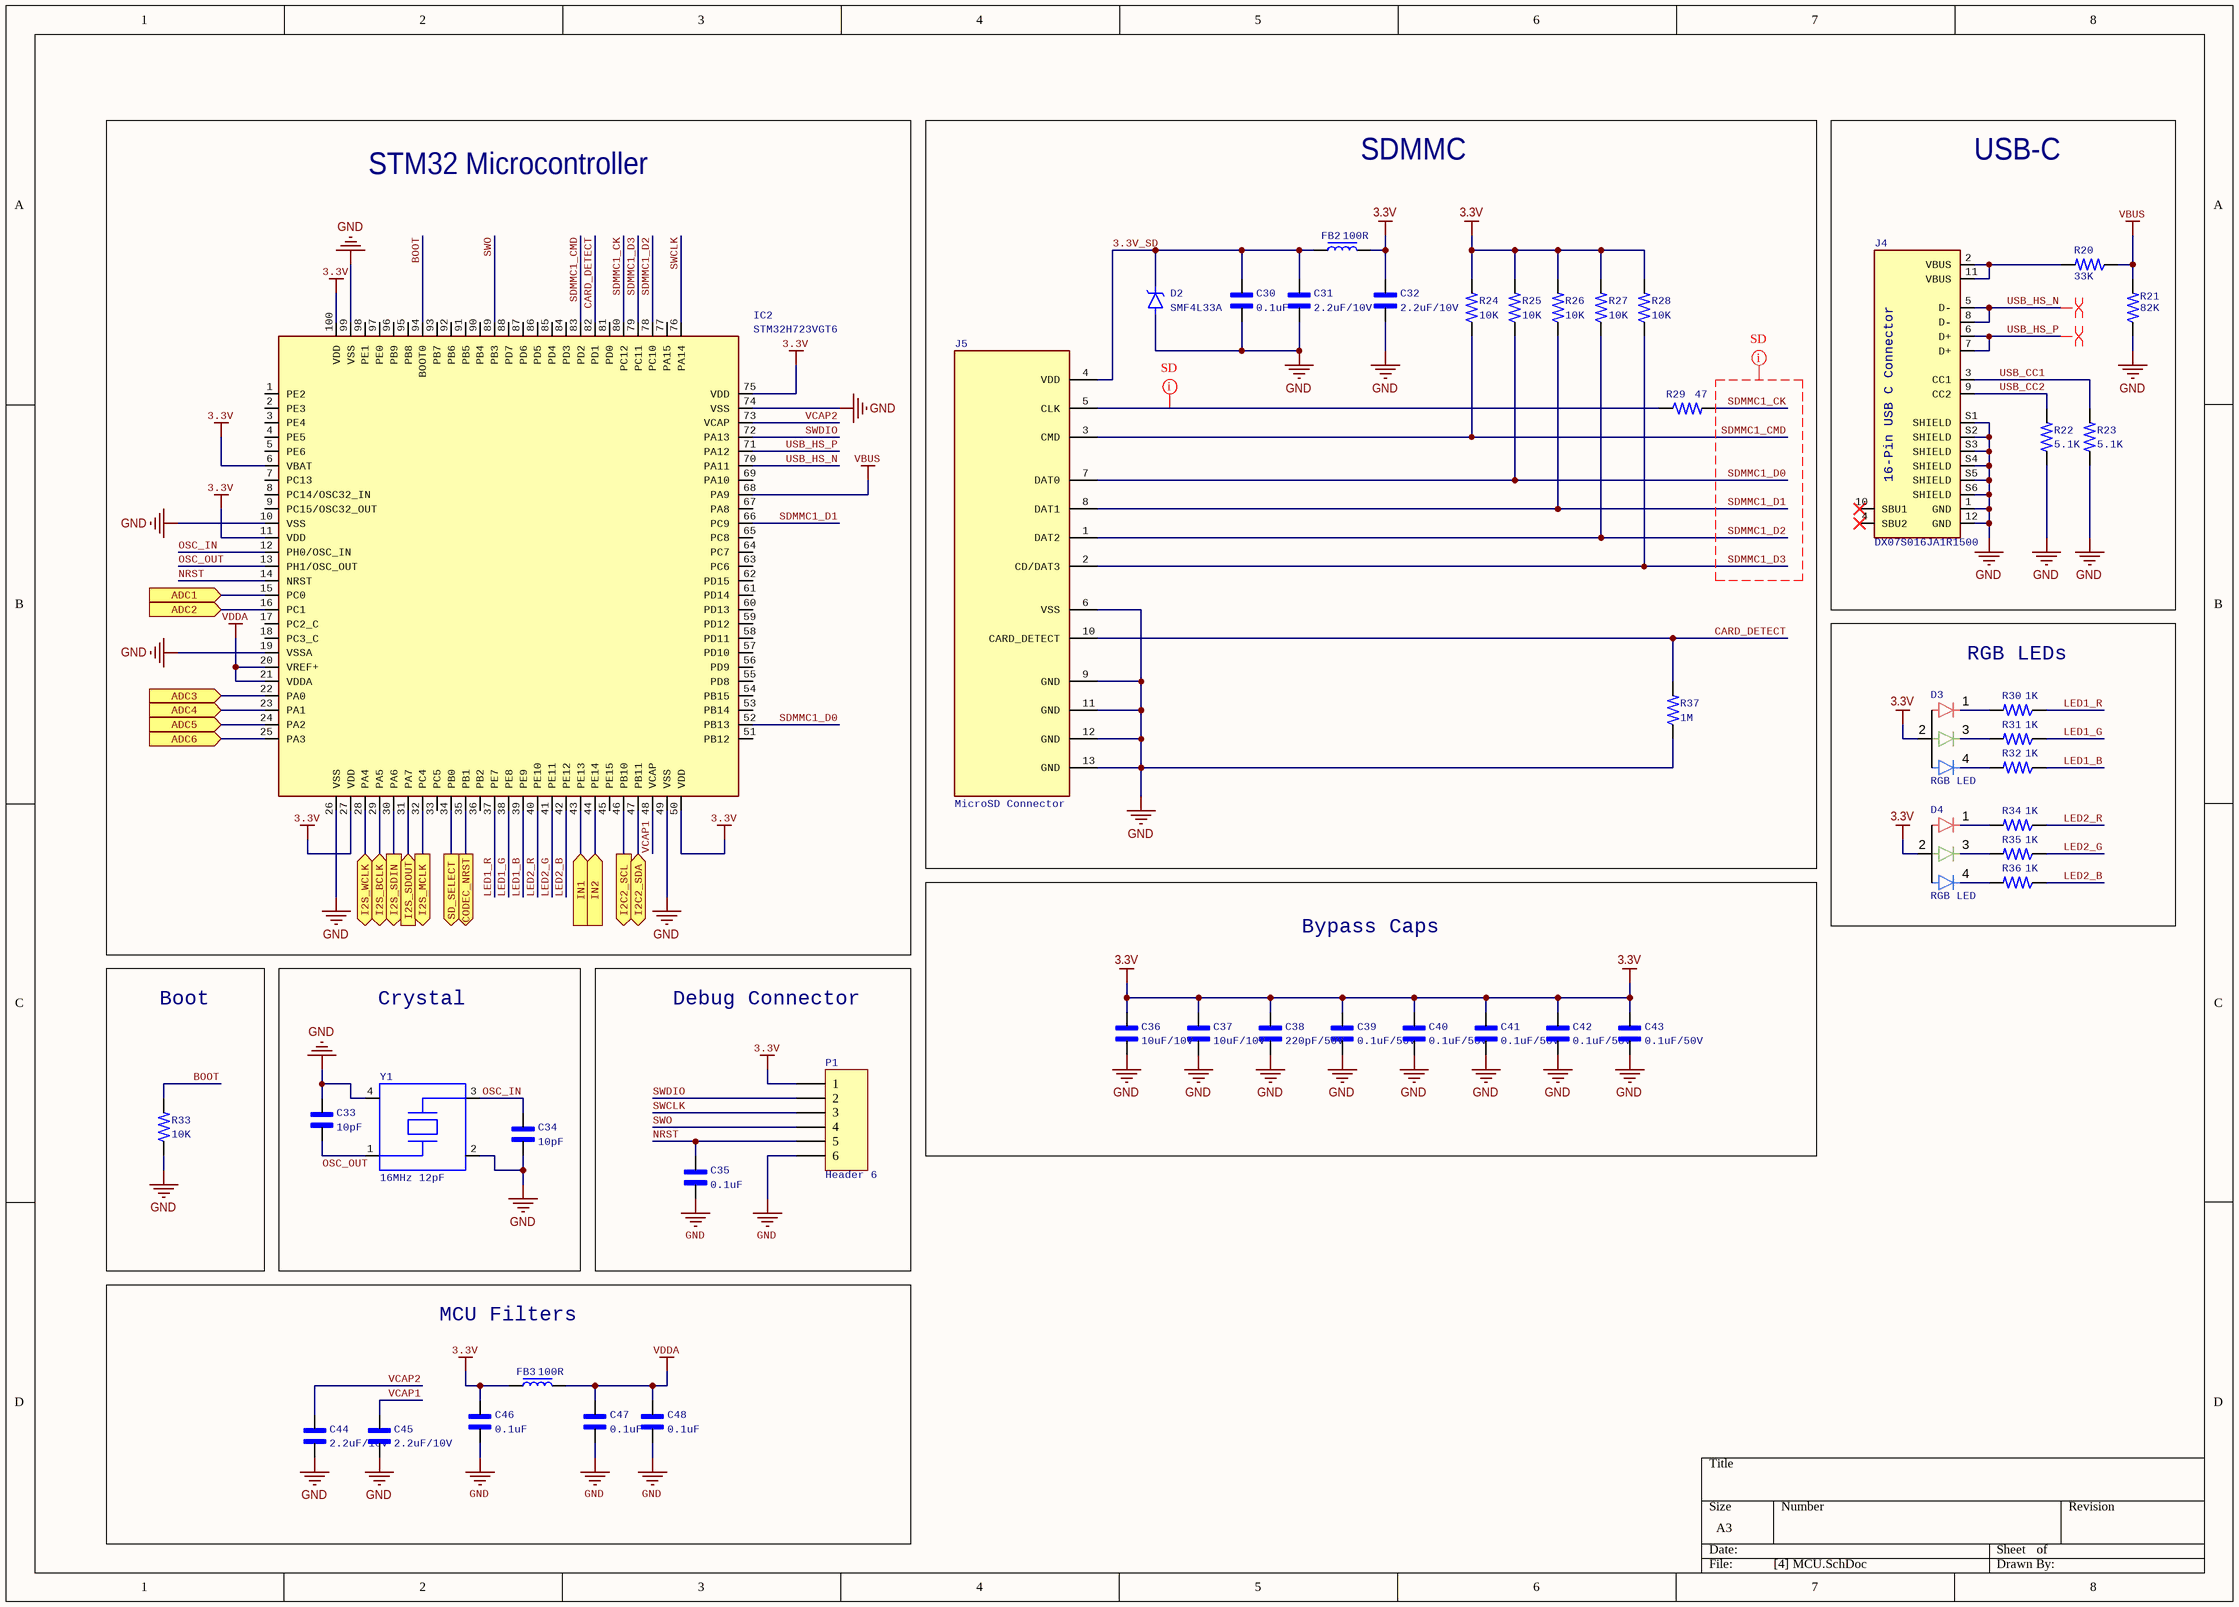
[diagram p3: [4] MCU.SchDoc]

### Parts
C30  0.1uF  [C0603]
C31  2.2uF/10V  [C0603]
C32  2.2uF/10V  [C0603]
C33  10pF  [C0603]
C34  10pF  [C0603]
C35  0.1uF  [C0603]
C36  10uF/10V  [C0603]
C37  10uF/10V  [C0603]
C38  220pF/50V  [C0603]
C39  0.1uF/50V  [C0603]
C40  0.1uF/50V  [C0603]
C41  0.1uF/50V  [C0603]
C42  0.1uF/50V  [C0603]
C43  0.1uF/50V  [C0603]
C44  2.2uF/10V  [C0603]
C45  2.2uF/10V  [C0603]
C46  0.1uF  [C0603]
C47  0.1uF  [C0603]
C48  0.1uF  [C0603]
D2  SMF4L33A  [SOD-123FL]
D3  RGB LED  [RGB LED CA]
D4  RGB LED  [RGB LED CA]
FB2  100R  [FB_0603]
FB3  100R  [FB_0603]
IC2  STM32H723VGT6  [QFP-100]
J4  DX07S016JA1R1500  [USB-C_JAE_DX07S016JA1R1500]
J5  MicroSD Connector  [DM3CSSF]
P1  Header 6  [HDR1X6]  (no BOM)
R20  33K  [R0603]
R21  82K  [R0603]
R22  5.1K  [R0603]
R23  5.1K  [R0603]
R24  10K  [R0603]
R25  10K  [R0603]
R26  10K  [R0603]
R27  10K  [R0603]
R28  10K  [R0603]
R29  47  [R0603]
R30  1K  [R0603]
R31  1K  [R0603]
R32  1K  [R0603]
R33  10K  [R0603]
R34  1K  [R0603]
R35  1K  [R0603]
R36  1K  [R0603]
R37  1M  [R0603]
Y1  16MHz 12pF  [XTAL 3.2 x 2.5 mm]

### Blocks framed on the sheet
STM32 Microcontroller: IC2
SDMMC: C30-C32 D2 FB2 J5 R24-R29 R37
USB-C: J4 R20-R23
RGB LEDs: D3 D4 R30-R32 R34-R36
Bypass Caps: C36-C43
Boot: R33
Crystal: C33 C34 Y1
Debug Connector: C35 P1
MCU Filters: C44-C48 FB3

### Ports
ADC1 (in), ADC2 (in), ADC3 (in), ADC4 (in), ADC5 (in), ADC6 (in), CODEC_NRST (out), I2C2_SCL (out), I2C2_SDA (bidir), I2S_BCLK (bidir), I2S_MCLK (out), I2S_SDIN (out), I2S_SDOUT (in), I2S_WCLK (bidir), IN1 (in), IN2 (in), SD_SELECT (out)

### Nets
3.3V: C32.1 C36.1 C37.1 C38.1 C39.1 C40.1 C41.1 C42.1 C43.1 C46.1 D3.2 D4.2 FB2.2 FB3.1 IC2.6(VBAT) IC2.11(VDD) IC2.27(VDD) IC2.50(VDD) IC2.75(VDD) IC2.100(VDD) P1.1 R24.2 R25.2 R26.2 R27.2 R28.2
GND: C30.2 C31.2 C32.2 C33.1 C34.1 C35.2 C36.2 C37.2 C38.2 C39.2 C40.2 C41.2 C42.2 C43.2 C44.2 C45.2 C46.2 C47.2 C48.2 D2.A IC2.10(VSS) IC2.19(VSSA) IC2.26(VSS) IC2.49(VSS) IC2.74(VSS) IC2.99(VSS) J4.1(GND) J4.12(GND) J4.S1(SHIELD) J4.S2(SHIELD) J4.S3(SHIELD) J4.S4(SHIELD) J4.S5(SHIELD) J4.S6(SHIELD) J5.6(VSS) J5.9(GND) J5.11(GND) J5.12(GND) J5.13(GND) P1.6 R21.1 R22.1 R23.1 R33.1 R37.1 Y1.2 Y1.4
VBUS: IC2.68(PA9) R20.1 R21.2
VDDA: C47.1 C48.1 FB3.2 IC2.20(VREF+) IC2.21(VDDA)
3.3V_SD: C30.1 C31.1 D2.C FB2.1 J5.4(VDD)
ADC1: IC2.15(PC0) ; port ADC1
ADC2: IC2.16(PC1) ; port ADC2
ADC3: IC2.22(PA0) ; port ADC3
ADC4: IC2.23(PA1) ; port ADC4
ADC5: IC2.24(PA2) ; port ADC5
ADC6: IC2.25(PA3) ; port ADC6
BOOT: IC2.94(BOOT0) R33.2
CARD_DETECT: IC2.82(PD1) J5.10(CARD_DETECT) R37.2
CODEC_NRST: IC2.35(PB1) ; port CODEC_NRST
I2C2_SCL: IC2.46(PB10) ; port I2C2_SCL
I2C2_SDA: IC2.47(PB11) ; port I2C2_SDA
I2S_BCLK: IC2.29(PA5) ; port I2S_BCLK
I2S_MCLK: IC2.32(PC4) ; port I2S_MCLK
I2S_SDIN: IC2.30(PA6) ; port I2S_SDIN
I2S_SDOUT: IC2.31(PA7) ; port I2S_SDOUT
I2S_WCLK: IC2.28(PA4) ; port I2S_WCLK
IN1: IC2.43(PE13) ; port IN1
IN2: IC2.44(PE14) ; port IN2
LED1_B: IC2.39(PE9) R32.1
LED1_G: IC2.38(PE8) R31.1
LED1_R: IC2.37(PE7) R30.1
LED2_B: IC2.42(PE12) R36.1
LED2_G: IC2.41(PE11) R35.1
LED2_R: IC2.40(PE10) R34.1
NRST: C35.1 IC2.14(NRST) P1.5
OSC_IN: C34.2 IC2.12(PH0/OSC_IN) Y1.3
OSC_OUT: C33.2 IC2.13(PH1/OSC_OUT) Y1.1
SD_SELECT: IC2.34(PB0) ; port SD_SELECT
SDMMC1_CK: IC2.80(PC12) R29.2
SDMMC1_CMD: IC2.83(PD2) J5.3(CMD) R24.1
SDMMC1_D0: IC2.52(PB13) J5.7(DAT0) R25.1
SDMMC1_D1: IC2.66(PC9) J5.8(DAT1) R26.1
SDMMC1_D2: IC2.78(PC10) J5.1(DAT2) R27.1
SDMMC1_D3: IC2.79(PC11) J5.2(CD/DAT3) R28.1
SWCLK: IC2.76(PA14) P1.3
SWDIO: IC2.72(PA13) P1.2
SWO: IC2.89(PB3) P1.4
USB_CC1: J4.3(CC1) R23.2
USB_CC2: J4.9(CC2) R22.2
USB_HS_N: IC2.70(PA11) J4.5(D-) J4.8(D-)
USB_HS_P: IC2.71(PA12) J4.6(D+) J4.7(D+)
VCAP1: C45.1 IC2.48(VCAP)
VCAP2: C44.1 IC2.73(VCAP)
NetD3_1: D3.1(R) R30.2
NetD3_3: D3.3 R31.2
NetD3_4: D3.4 R32.2
NetD4_1: D4.1(R) R34.2
NetD4_3: D4.3 R35.2
NetD4_4: D4.4 R36.2
NetJ4_2: J4.2(VBUS) J4.11(VBUS) R20.2
NetJ5_5: J5.5(CLK) R29.1

Not connected (* = marked no-connect by the designer): IC2 1(PE2) 2(PE3) 3(PE4) 4(PE5) 5(PE6) 7(PC13) 8(PC14/OSC32_IN) 9(PC15/OSC32_OUT) 17(PC2_C) 18(PC3_C) 33(PC5) 36(PB2) 45(PE15) 51(PB12) 53(PB14) 54(PB15) 55(PD8) 56(PD9) 57(PD10) 58(PD11) 59(PD12) 60(PD13) 61(PD14) 62(PD15) 63(PC6) 64(PC7) 65(PC8) 67(PA8) 69(PA10) 77(PA15) 81(PD0) 84(PD3) 85(PD4) 86(PD5) 87(PD6) 88(PD7) 90(PB4) 91(PB5) 92(PB6) 93(PB7) 95(PB8) 96(PB9) 97(PE0) 98(PE1); J4 4(SBU2)* 10(SBU1)*

### Layout directives
net class SD: NetJ5_5, SDMMC1_CK, SDMMC1_CMD, SDMMC1_D0, SDMMC1_D1, SDMMC1_D2, SDMMC1_D3
differential pair; differential pair class USB: USB_HS_N, USB_HS_P

### Notes on the sheet
- (in symbol USB C 16-Pin) 16-Pin USB C Connector

### Library data of the parts
C30 C35 C39-C43 C46-C48 = C0603 0.1uF/50V: MLCC 0.1uF 50V X5R 10% 0603; Manufacturer: TDK; Manufacturer Part Number: C1608X5R1H104K080AA; Dielectric Material: Ceramic; Capacitance: 100nF; Supplier 1: Mouser; Supplier Part Number 1: 810-C1608X5R1H104K; RoHS: Yes; Category: Ceramic Capacitors; Stock 1: 520600; Pricing 1: 1=0.12000, 10=0.04500, 100=0.03700, 500=0.02600, 1000=0.02100, 4000=0.01800 (USD); Mount: Surface Mount; Case/Package: 0603; Number of Pins: 2; Case Code (Metric): 1608; Case Code (Imperial): 0603; Weight: 7.1E-05oz; Min Operating Temperature: -55°C; Max Operating Temperature: 85°C; Tolerance: 10%; Dielectric: X5R; Voltage Rating: 50V; Packaging: Tape and Reel; Voltage Rating (DC): 50V; Termination: SMD/SMT; Package Quantity: 1; Resistor Type: Ceramic; Length: 1.6mm; Width: 0.031inch; Height: 0.8mm; Depth: 0.8mm; Thickness: 0.035inch; Radiation Hardening: No; REACH SVHC: No SVHC; Lead Free: Lead Free; Supplier 2: Mouser; Supplier Part Number 2: 187-CL10B104KB8NNNC
C31 C32 C44 C45 = C0603 2.2uF/10V: MLCC 2.2uF 10V X5R 10% 0603; Manufacturer: Samsung; Manufacturer Part Number: CL10A225KP8NNNC; Material: Ceramic; Supplier 1: Mouser; Supplier Part Number 1: 187-CL10A225KP8NNNC; RoHS: Yes; Category: Ceramic Capacitors; Stock 1: 763370; Pricing 1: 1=0.10000, 10=0.06100, 100=0.02700, 500=0.01900, 1000=0.01500, 2500=0.01100 (USD); Mount: Surface Mount; Case/Package: 0603; Case Code (Metric): 1608; Case Code (Imperial): 0603; Min Operating Temperature: -55°C; Max Operating Temperature: 85°C; Tolerance: 10%; Capacitance: 2.2uF; Dielectric: X5R; Package Quantity: 1; Packaging: Tape and Reel; Voltage Rating: 10V; Voltage: 10V; Voltage Rating (DC): 10V; Length: 1.6mm; Width: 0.031inch; Height: 0.8mm; Thickness: 0.035inch; Depth: 0.8mm; Radiation Hardening: No; Lead Free: Lead Free
C33 C34 = C0603 10pF/50V: MLCC 10pF 50V X7R 10% 0603; Manufacturer: KEMET; Manufacturer Part Number: C0603C100K5RACTU; Dielectric Material: Ceramic; Supplier 1: Mouser; Supplier Part Number 1: 80-C0603C100K5R; RoHS: No; Category: Ceramic Capacitors; Stock 1: 10694; Pricing 1: 1=0.24000, 10=0.11000, 50=0.11000, 100=0.09400, 1000=0.05800, 10000=0.04100 (USD); Case/Package: 0603; Voltage Rating (DC): 50V; Dielectric: X7R; Tolerance: 10%; Capacitance: 10pF; Supplier 2: Mouser; Supplier Part Number 2: 581-06035C100KAT2A
C36 C37 = C0603 10uF/10V: MLCC 10uF 10V X5R 20% 0603; Manufacturer: KEMET; Manufacturer Part Number: C0603C106M8PAC7867; Supplier 1: Mouser; Supplier Part Number 1: 80-C0603C106M8PACTU; RoHS: Yes; Category: Ceramic Capacitors; Stock 1: 19357; Pricing 1: 1=0.46000, 10=0.24500, 50=0.24500, 100=0.21300, 1000=0.13400, 10000=0.10600 (USD); Supplier 2: Digi-Key; Supplier Part Number 2: 399-14945-6-ND; Mount: Surface Mount; Case/Package: 0603; Case Code (Imperial): 0603; Case Code (Metric): 1608; Min Operating Temperature: -55°C; Max Operating Temperature: 85°C; Packaging: Cut Tape; Capacitance: 10uF; Tolerance: 20%; Voltage Rating: 10V; RoHS Compliant: Yes
C38 = C0603 220pF/50V: MLCC 220pF 50V X7R 10% 0603; Manufacturer: KEMET; Manufacturer Part Number: C0603C221K5RACTU; Dielectric Material: Ceramic; Supplier 1: Mouser; Supplier Part Number 1: 80-C0603C221K5R; RoHS: Yes; Category: Ceramic Capacitors; Stock 1: 91306; Pricing 1: 1=0.10000, 10=0.03100, 100=0.02100, 500=0.01800, 1000=0.01400, 4000=0.01100 (USD); Mount: Surface Mount; Case/Package: 0603; Min Operating Temperature: -55°C; Max Operating Temperature: 125°C; Packaging: Tape and Reel; Tolerance: 10%; Capacitance: 220pF; Dielectric: X7R; Termination: SMD/SMT; Voltage Rating (DC): 50V; Voltage: 50V; Length: 1.6mm; Height: 0.8mm; Depth: 0.8mm; Radiation Hardening: No
D2 = ESD Diode SMF4L33A: TVS DIODE, 2KW, 33V, UNIDIR, SOD-123FL; Manufacturer: Littelfuse; Number of Unidirectional Channels: 1; Min Breakdown Voltage: 36.7V; Clamping Voltage: 53.3V; Peak Pulse Current: 7.5A; Peak Pulse Power: 400W; Power Line Protection: No; Supplier 1: Mouser; Supplier Part Number 1: 576-SMF4L33A; Manufacturer Part Number: SMF4L33A; RoHS: Yes; Category: TVS Diodes; Stock 1: 5344; Pricing 1: 1=0,46000, 10=0,30000, 50=0,30000, 100=0,16700, 1000=0,12500, 10000=0,10100 (USD); Mount: Surface Mount; Min Operating Temperature: -55°C; Max Operating Temperature: 150°C; Resistor Type: Zener; Packaging: Tape and Reel; Reverse Standoff Voltage: 33V; RoHS Compliant: Yes
D3 D4 = RGB LED CA PTH: LED RGB CLEAR T-1 3/4 T/H CA; Manufacturer: Kingbright; Manufacturer Part Number: WP154A4SEJ3VBDZGC/CA; Supplier 1: Mouser; Supplier Part Number 1: 604-WP154A43VBDZGCCA; RoHS: No; Category: LEDs; Stock 1: 4623; Pricing 1: 1=1.99000, 10=1.51000, 100=1.05000, 250=1.02000, 500=0.93600, 1000=0.83500 (USD)
FB2 FB3 = FB_0603: Ferrite Bead SMD 0603
IC2 = STM32H723VGT6: MCU 32-bit ARM Cortex M7 RISC 1MB Flash 1.8V/2.5V/3.3V 100-Pin LQFP Tray; Manufacturer: STMicroelectronics; Supplier 1: Mouser; Manufacturer Part Number: STM32H723VGT6; RoHS: Yes; Category: Microcontrollers; Stock 1: 2663; Pricing 1: 1=12.88, 10=11.84, 50=10.07, 100=10, 1000=8.84, 10000=8.84 (USD); Supplier Part Number 1: 511-STM32H723VGT6
J4 = USB C 16-Pin: USB-C (USB TYPE-C) USB 2.0 Receptacle Connector 24 (16+8 Dummy) SMT, Right Angle; Through Hole; Manufacturer: JAE Electronics; Supplier 1: Mouser; Supplier Part Number 1: 656-DX07S016JA1R1500; Manufacturer Part Number: DX07S016JA1R1500; RoHS: No; Stock 1: 11168; Pricing 1: 1=1.51000, 10=1.23000, 50=1.23000, 100=1.17000, 1000=0.83900, 10000=0.72800 (USD)
J5 = DM3CS-SF: Connector, Memory, Micro Sd, DM3CS-SF; Manufacturer: Hirose; Pitch: 1.1mm; Current Rating: 500mA; Voltage Rating (AC): 125V; Gender: Female; Insulation Resistance: 1GR; Number of Positions: 8; Contact Resistance: 100mR; Connector Type: Connector; Packaging: Tape and Reel; Flammability Rating: UL94 V-0; Min Operating Temperature: -25°C; Orientation: Right Angle; Width: 13.8mm; Number of Rows: 1; Housing Material: Polymer; Mount: Surface Mount; Max Current Rating: 500mA; Radiation Hardening: No; Max Operating Temperature: 85°C; Contact Plating: Gold; Depth: 1.83mm; Contact Material: Gold,Copper Alloy,Copper; Length: 14.1mm; Number of Contacts: 8; Termination: Solder; Supplier 1: Mouser; RoHS: Yes; Category: Memory Connectors; Stock 1: 85183; Pricing 1: 1=1.55, 10=1.27, 50=1.27, 100=1.1, 1000=1.01, 10000=0.748 (USD); Series: DM3; RoHS Compliant: Yes; Reach SVHC Compliant: Unknown; Supplier Part Number 1: 798-DM3CSSF; Manufacturer Part Number: DM3CS-SF
P1 = Header 6: Header, 6-Pin; LatestRevisionDate: 17-Jul-2002; LatestRevisionNote: Re-released for DXP Platform.; Publisher: Altium Limited
R20 = R0603 33K: RES 0603 33K 1% 1/10W; Manufacturer: Yageo; Manufacturer Part Number: AC0603FR-1333KL; Supplier 1: Mouser; Supplier Part Number 1: 603-AC0603FR-1333KL; RoHS: Yes; Category: Chip SMD Resistors; Stock 1: 42354; Pricing 1: 1=0,10000, 10=0,03000, 50=0,03000, 100=0,01300, 1000=0,00600, 10000=0,00400 (USD); RoHS Compliant: Yes
R21 = R0603 82K: RES 0603 82K OHM 0.5% 1/10W; Manufacturer: Yageo; Manufacturer Part Number: RC0603FR-0782KL; Tolerance: 1%; Resistance: 82kR; Power Rating: 100mW; Voltage Rating: 75V; Voltage Rating (DC): 50V; Temperature Coefficient: 100ppm/°C; Supplier 1: Mouser; Supplier Part Number 1: 603-RC0603FR-0782KL; RoHS: Yes; Category: Chip SMD Resistors; Stock 1: 4847; Pricing 1: 1=0.10000, 10=0.01800, 50=0.01800, 100=0.00600, 1000=0.00500, 10000=0.00300 (USD); Case/Package: 0603; Number of Pins: 2; Case Code (Imperial): 0603; Case Code (Metric): 1608; Weight: 7.1E-05oz; Size Code: 0603; Min Operating Temperature: -55°C; Max Operating Temperature: 155°C; Packaging: Tape and Reel; Termination: SMD/SMT; Resistor Type: Thick Film; Features: Moisture Resistant; Series: RC; Max Power Dissipation: 100mW; Number of Terminations: 2; Construction: Rectangular; Technology: THICK FILM; Resistance Tolerance: 1%; Length: 1.6mm; Width: 0.8mm; Height: 0.45mm; Depth: 0.8mm; REACH SVHC: No SVHC; Military Standard: Not; Lead Free: Lead Free; RoHS Compliant: Yes
R22 R23 = R0603 5.1K: RES 0603 5.1K OHM 1% 1/10W; Manufacturer: Yageo; Manufacturer Part Number: RC0603FR-075K1L; Power Rating: 100mW; Temperature Coefficient: 100ppm/°C; Resistance: 5.1kR; Voltage Rating: 50V; Supplier 1: Mouser; Supplier Part Number 1: 603-RC0603FR-075K1L; RoHS: Yes; Category: Chip SMD Resistors; Stock 1: 557916; Case/Package: 0603; Number of Pins: 2; Case Code (Imperial): 0603; Case Code (Metric): 1608; Min Operating Temperature: -55°C; Max Operating Temperature: 155°C; Tolerance: 1%; Packaging: Tape and Reel; Package Quantity: 1; Termination: SMD/SMT; Resistor Type: Thick Film; Number of Terminations: 2; Max Power Dissipation: 100mW; Voltage Rating (DC): 50V; Features: Moisture Resistant; Length: 0.063inch; Width: 0.031inch; Height: 0.022inch; Depth: 0.8mm; REACH SVHC: No SVHC; Military Standard: Not; Lead Free: Lead Free
R24-R28 R33 = R0603 10K: RES 0603 10K OHM 1% 1/10W; Manufacturer: Yageo; Manufacturer Part Number: RC0603FR-1310KL; Resistance: 10kR; Power Rating: 100mW; Voltage Rating: 50V; Temperature Coefficient: 100ppm/°C; Supplier 1: Mouser; Supplier Part Number 1: 603-RC0603FR-1310KL; RoHS: Yes; Category: Chip SMD Resistors; Stock 1: 50990; Pricing 1: 1=0.10000, 10=0.01800, 50=0.01800, 100=0.00600, 1000=0.00500, 2500=0.00400, 10000=0.00400 (USD); Case/Package: 0603; Number of Pins: 2; Case Code (Imperial): 0603; Case Code (Metric): 1608; Size Code: 0603; Min Operating Temperature: -55°C; Max Operating Temperature: 155°C; Tolerance: 1%; Packaging: Tape and Reel; Resistor Type: Thick Film; Termination: SMD/SMT; Voltage Rating (DC): 50V; Series: RC; Resistance Tolerance: 1%; Construction: Rectangular; Length: 1.6mm; Depth: 0.8mm; RoHS Compliant: Yes; REACH SVHC: No SVHC; Military Standard: Not; Lead Free: Lead Free; ComponentLink1URL: https://datasheet.ciiva.com/7983/443971-7983673.pdf?src-supplier=Element14; ComponentLink1Description: https://datasheet.ciiva.com/7983/443971-7983673.pdf?src-supplier=Element14; ComponentLink2URL: https://datasheet.ciiva.com/16850/pyu-rc0603-51-rohs-l-4-16850349.pdf?src-supplier=Future+Electronics; ComponentLink2Description: https://datasheet.ciiva.com/16850/pyu-rc0603-51-rohs-l-4-16850349.pdf?src-supplier=Future+Electronics
R29 = R0603 47: RES 0603 47 1% 1/10W; Manufacturer: Yageo; Manufacturer Part Number: RC0603FR-0747RL; Resistance: 47R; Power Rating: 100mW; Voltage Rating (DC): 50V; Temperature Coefficient: 100ppm/°C; Voltage Rating: 75V; Supplier 1: Mouser; Supplier Part Number 1: 603-RC0603FR-0747RL; RoHS: Yes; Category: Chip SMD Resistors; Stock 1: 267107; Case/Package: 0603; Number of Pins: 2; Case Code (Imperial): 0603; Case Code (Metric): 1608; Weight: 7.1E-05oz; Min Operating Temperature: -55°C; Max Operating Temperature: 155°C; Tolerance: 1%; Packaging: Tape and Reel; Package Quantity: 1; Termination: SMD/SMT; Resistor Type: Thick Film; Number of Terminations: 2; Max Power Dissipation: 100mW; Features: Moisture Resistant; Length: 1.6mm; Width: 0.8mm; Height: 0.45mm; Depth: 0.8mm; REACH SVHC: Unknown; Lead Free: Lead Free; Military Standard: Not
R30-R32 R34-R36 = R0603 1K: RES 0603 1K OHM 1% 1/10W; Manufacturer: Yageo; Manufacturer Part Number: RC0603FR-071KL; Resistance: 1kR; Temperature Coefficient: 100ppm/°C; Power Rating: 100mW; Voltage Rating: 50V; Supplier 1: Mouser; Supplier Part Number 1: 603-RC0603FR-071KL; RoHS: Yes; Category: Chip SMD Resistors; Stock 1: 1697496; Pricing 1: 1=0.10000, 10=0.02100, 50=0.02100, 100=0.00700, 1000=0.00400, 10000=0.00200 (USD); Case/Package: 0603; Contact Plating: Tin,Matte; Case Code (Imperial): 0603; Case Code (Metric): 1608; Size Code: 0603; Min Operating Temperature: -55°C; Max Operating Temperature: 155°C; Tolerance: 1%; Resistor Type: Thick Film; Packaging: Tape and Reel; Termination: SMD/SMT; Features: Moisture Resistant; Series: RC; Max Power Dissipation: 100mW; Number of Terminations: 2; Technology: THICK FILM; Resistance Tolerance: 1%; Construction: Rectangular; Length: 1.6mm; Height: 0.45mm; Depth: 0.8mm; Radiation Hardening: No; REACH SVHC: No SVHC; Military Standard: Not; Lead Free: Lead Free; RoHS Compliant: Yes
R37 = R0603 1M: as R4 on sheet [2] Analog Front-End; Supplier 1: Mouser; Supplier Part Number 1: 603-RC0603FR-071ML; RoHS: Yes; Category: Chip SMD Resistors; Stock 1: 1321822; Pricing 1: 1=0.10000, 10=0.01800, 50=0.01800, 100=0.00700, 1000=0.00400, 10000=0.00200 (USD); Case/Package: 0603; Number of Pins: 2; Case Code (Imperial): 0603; Case Code (Metric): 1608; Weight: 0.000847oz; Min Operating Temperature: -55°C; Max Operating Temperature: 155°C; Tolerance: 1%; Packaging: Cut Tape; Package Quantity: 5000; Termination: SMD/SMT; Resistor Type: Thick Film; Type: General Purpose; Series: RC; Technology: THICK FILM; Length: 1.6mm; Width: 0.8mm; Height: 0.45mm; Depth: 0.8mm; RoHS Compliant: Yes; REACH SVHC: No SVHC; Military Standard: Not; Lead Free: Lead Free
Y1 = XTAL 16MHz 12pF: Crystal 16MHz ±50ppm (Tol) ±100ppm (Stability) 12pF FUND 80Ohm 4-Pin SMD T/R; Manufacturer: Kyocera AVX; Manufacturer Part Number: CX3225SB16000H0PSTC1; ESR (Equivalent Series Resistance): 80R; Supplier 1: Mouser; Supplier Part Number 1: 581-CX3225SB16H0PST; RoHS: Yes; Pricing 1: 1=0.69000, 10=0.57500, 50=0.57500, 100=0.46000, 1000=0.36800, 10000=0.34400 (USD); Mount: Surface Mount; Case/Package: SMD/SMT; Min Operating Temperature: -40°C; Max Operating Temperature: 125°C; Packaging: Tape and Reel; Frequency: 16MHz; Frequency Stability: 100ppm; RoHS Compliant: Yes; Stock 1: 2997; Frequency Tolerance: 50ppm; Load Capacitance: 12pF; Category: Crystals; Length: 0.126inch; Width: 0.098inch; Height: 0.024inch; Ratings: AEC-Q200

## Sheet [5] Connectors.SchDoc
size A4
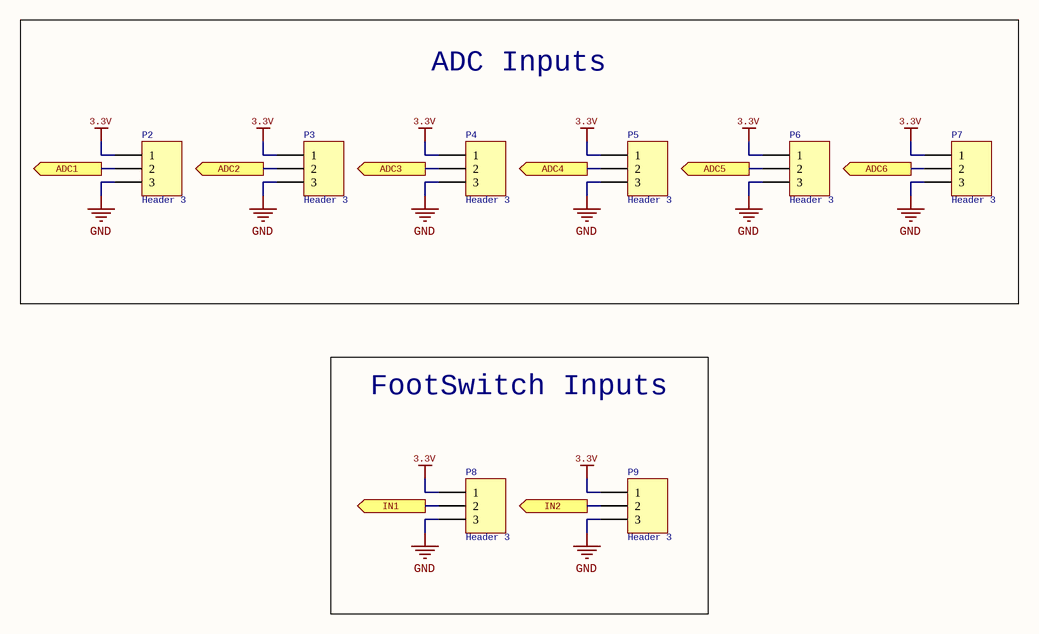
[diagram p4: [5] Connectors.SchDoc]

### Parts
P2  Header 3  [HDR1X3]  (no BOM)
P3  Header 3  [HDR1X3]  (no BOM)
P4  Header 3  [HDR1X3]  (no BOM)
P5  Header 3  [HDR1X3]  (no BOM)
P6  Header 3  [HDR1X3]  (no BOM)
P7  Header 3  [HDR1X3]  (no BOM)
P8  Header 3  [HDR1X3]  (no BOM)
P9  Header 3  [HDR1X3]  (no BOM)

### Blocks framed on the sheet
ADC Inputs: P2-P7
FootSwitch Inputs: P8 P9

### Ports
ADC1 (out), ADC2 (out), ADC3 (out), ADC4 (out), ADC5 (out), ADC6 (out), IN1 (out), IN2 (out)

### Nets
3.3V: P2.1 P3.1 P4.1 P5.1 P6.1 P7.1 P8.1 P9.1
GND: P2.3 P3.3 P4.3 P5.3 P6.3 P7.3 P8.3 P9.3
ADC1: P2.2 ; port ADC1
ADC2: P3.2 ; port ADC2
ADC3: P4.2 ; port ADC3
ADC4: P5.2 ; port ADC4
ADC5: P6.2 ; port ADC5
ADC6: P7.2 ; port ADC6
IN1: P8.2 ; port IN1
IN2: P9.2 ; port IN2

### Library data of the parts
P2-P9 = Header 3: Header, 3-Pin; LatestRevisionDate: 17-Jul-2002; LatestRevisionNote: Re-released for DXP Platform.; Publisher: Altium Limited

## Nets that join several sheets
3.3V: [1] Power Supply (C2.1 U1.1 U1.2), [3] Audio Codec (7 pins), [4] MCU (26 pins), [5] Connectors (8 pins)
5VA: [1] Power Supply (6 pins), [2] Analog Front-End (C12.1 C17.1 U3.5 U4.5), [3] Audio Codec (C21.1 C22.2 IC1.19)
GND: [1] Power Supply (17 pins), [2] Analog Front-End (11 pins), [3] Audio Codec (16 pins), [4] MCU (47 pins), [5] Connectors (8 pins)
VREF: [1] Power Supply (C11.1 R2.2 R3.1), [2] Analog Front-End (R4.2 R8.2)
ADC1: [4] MCU (IC2.15), [5] Connectors (P2.2)
ADC2: [4] MCU (IC2.16), [5] Connectors (P3.2)
ADC3: [4] MCU (IC2.22), [5] Connectors (P4.2)
ADC4: [4] MCU (IC2.23), [5] Connectors (P5.2)
ADC5: [4] MCU (IC2.24), [5] Connectors (P6.2)
ADC6: [4] MCU (IC2.25), [5] Connectors (P7.2)
CODEC_IN_L: [2] Analog Front-End (C14.2), [3] Audio Codec (IC1.22)
CODEC_NRST: [3] Audio Codec (IC1.14 R19.2), [4] MCU (IC2.35)
CODEC_OUT_L: [2] Analog Front-End (C18.1), [3] Audio Codec (IC1.15)
I2C2_SCL: [3] Audio Codec (IC1.10 R12.1), [4] MCU (IC2.46)
I2C2_SDA: [3] Audio Codec (IC1.9 R13.1), [4] MCU (IC2.47)
I2S_BCLK: [3] Audio Codec (IC1.4), [4] MCU (IC2.29)
I2S_MCLK: [3] Audio Codec (IC1.3), [4] MCU (IC2.32)
I2S_SDIN: [3] Audio Codec (IC1.1), [4] MCU (IC2.30)
I2S_SDOUT: [3] Audio Codec (IC1.7 R14.2 R15.2), [4] MCU (IC2.31)
I2S_WCLK: [3] Audio Codec (IC1.2), [4] MCU (IC2.28)
IN1: [4] MCU (IC2.43), [5] Connectors (P8.2)
IN2: [4] MCU (IC2.44), [5] Connectors (P9.2)
SD_SELECT: [3] Audio Codec (R14.1), [4] MCU (IC2.34)